# Altium schematic sheet HS_LS_Switch_LOW_PWR.SchDoc: Data Logger - HS LS Low Power Switches
size A4; DocumentNumber: DL-MB-11; SheetNumber: 11; SheetTotal: 11
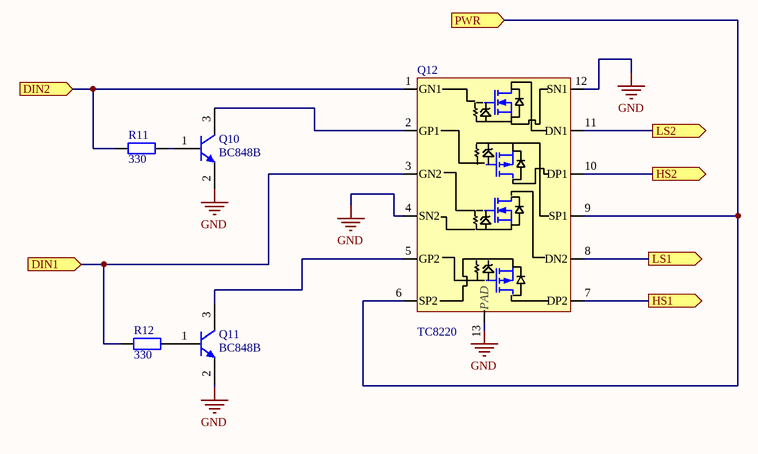
[diagram p0: HS_LS_Switch_LOW_PWR.SchDoc]

## Parts
Q10  BC848B  [SOT23_N]
Q11  BC848B  [SOT23_N]
Q12  TC8220  [DFN400X400X100-12]
R11  330  [RES-1206_M]
R12  330  [RES-1206_M]

## Ports
DIN1 (in), DIN2 (in), HS1 (out), HS2 (out), LS1 (out), LS2 (out), PWR (in)

## Nets
GND: Q10.2(E) Q11.2(E) Q12.4(SN2) Q12.12(SN1) Q12.13(PAD)
DIN1: Q12.3(GN2) R12.1 ; port DIN1
DIN2: Q12.1(GN1) R11.1 ; port DIN2
HS1: Q12.7(DP2) ; port HS1
HS2: Q12.10(DP1) ; port HS2
LS1: Q12.8(DN2) ; port LS1
LS2: Q12.11(DN1) ; port LS2
PWR: Q12.6(SP2) Q12.9(SP1) ; port PWR
NetQ10_1: Q10.1(B) R11.2
NetQ10_3: Q10.3(C) Q12.2(GP1)
NetQ11_1: Q11.1(B) R12.2
NetQ11_3: Q11.3(C) Q12.5(GP2)

## Notes on the sheet
- Title
- Size
- Date:
- A4
- Number
- Time:
- Sheet
- of
- Revision
- File:
- Drawn By:

## Library data of the parts
Q10 Q11 = BC848B: NPN Silicon AF Transistor, 30 V VCEO, 100 mA IC, SOT23, Reel, Green; Manufacturer: Infineon; fT (typ): 250 MHz; Green: TRUE; IBM (max): 200 mA; IC (max): 100 mA; ICBO (max): 15 nA; Ptot (max): 330 mW; VCBO (max): 30 V; VEBO (max): 6 V; PackageVersion: Apr-08; PackageReference: SOT23; PackageDescription: 3-Pin Small Outline Transistor Package, 1.3 x 2.9 mm Body, 0.95 mm Pitch; ICM (max): 200 mA; Packing: Reel; Polarity: NPN; VCEO (max): 30 V; Mounting Technology: Surface Mount; PartNumber: BC848B; ComponentLink1Description: Manufacturer URL; ComponentLink1URL: http://www.infineon.com/; ComponentLink2Description: Datasheet; ComponentLink2URL: http://www.infineon.com/dgdl/bc847series_bc848series_bc849series_bc850series.pdf?folderId=db3a304314dca389011541d30fa21656&fileId=db3a304314dca389011541d4630a1657; ComponentLink3Description: Package Specification; ComponentLink3URL: http://www.infineon.com/dgdl/SOT23-Package_Overview.pdf?folderId=db3a30431936bc4b0119532290053c66&fileId=db3a30431936bc4b0119533468123c85
Q12 = TC8220: Two pair, N- & P-Channel Enhancement MOSFET; PackageReference: DFN-12
R11 R12 = Res2: Resistor; Published: 8-Jun-2000; LatestRevisionDate: 17-Jul-2002; LatestRevisionNote: Re-released for DXP Platform.; PackageReference: 1206; Publisher: Altium Limited; PackageDescription: Chip Resistor 1206 Case Size; Value: 330